# EAGLE design motor_ctrl_pw_v2 (EAGLE 5.06)
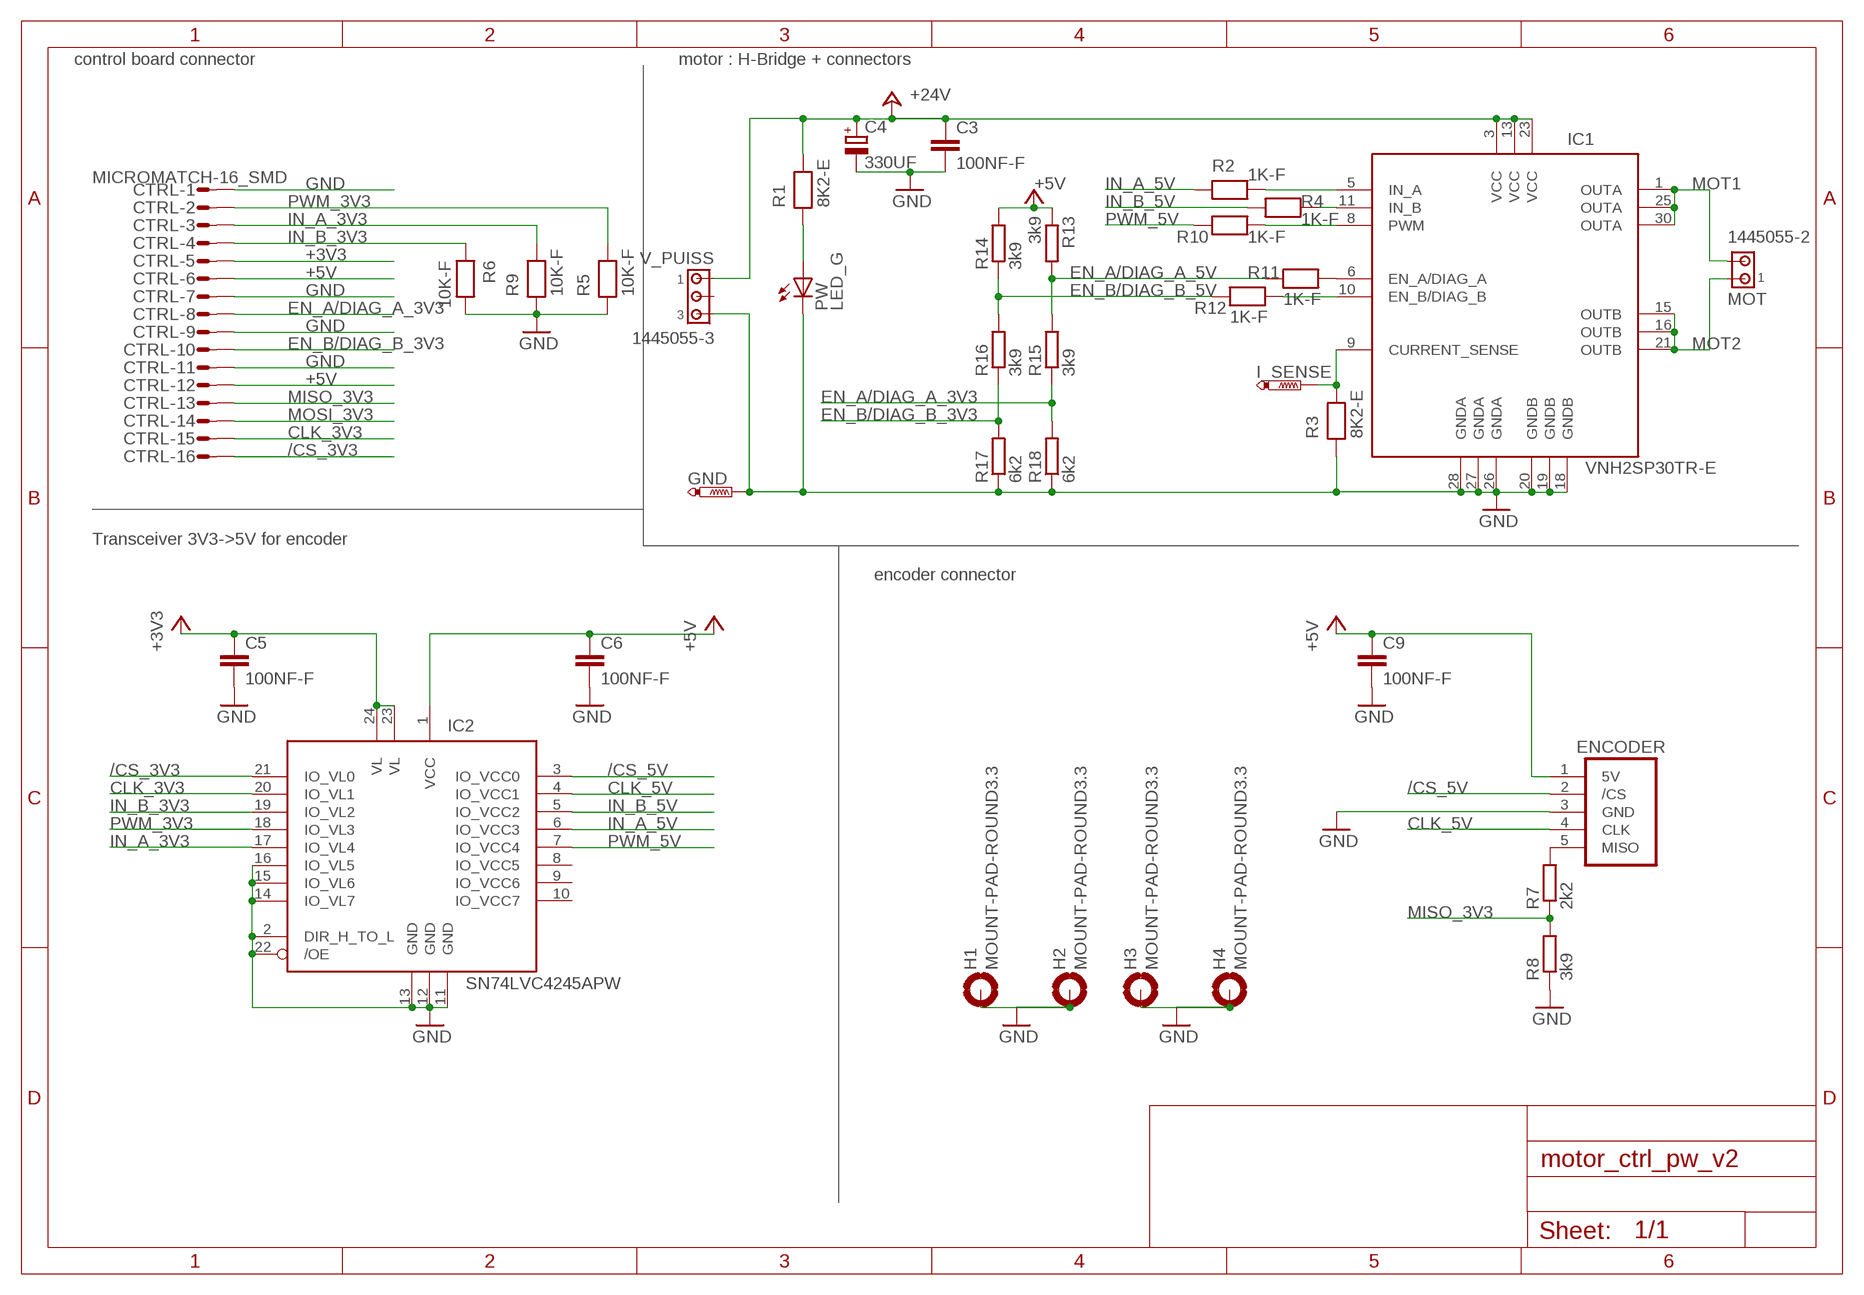
[diagram p0: schematic, sheet 1]

## Parts
C3  100NF-F  [C0603]
C4  330UF  [PANASONIC_G]
C5  100NF-F  [C0603]
C6  100NF-F  [C0603]
C9  100NF-F  [C0603]
CTRL  MICROMATCH-16_SMD  [MICROMATCH-16_SMD]
ENCODER  AEAT-601X  [53047-05]
GND  PTR1PAD1-13  [P1-13]
H1  MOUNT-PAD-ROUND3.3  [3,3-PAD]
H2  MOUNT-PAD-ROUND3.3  [3,3-PAD]
H3  MOUNT-PAD-ROUND3.3  [3,3-PAD]
H4  MOUNT-PAD-ROUND3.3  [3,3-PAD]
I_SENSE  PTR1PAD1-13  [P1-13]
IC1  VNH2SP30TR-E  [MULTIPOWER_SO-30]
IC2  SN74LVC4245APW  [TSSOP24]
MOT  1445055-2  [1445055-2]
PW  LED_G  [CHIP-LED0805]
R1  8K2-E  [R0805]
R2  1K-F  [R0603]
R3  8K2-E  [R0805]
R4  1K-F  [R0603]
R5  10K-F  [R0603]
R6  10K-F  [R0603]
R7  2k2  R-EU_R0603  [R0603]
R8  3k9  R-EU_R0603  [R0603]
R9  10K-F  [R0603]
R10  1K-F  [R0603]
R11  1K-F  [R0603]
R12  1K-F  [R0603]
R13  3k9  R-EU_R0603  [R0603]
R14  3k9  R-EU_R0603  [R0603]
R15  3k9  R-EU_R0603  [R0603]
R16  3k9  R-EU_R0603  [R0603]
R17  6k2  R-EU_R0603  [R0603]
R18  6k2  R-EU_R0603  [R0603]
V_PUISS  1445055-3  [1445055-3]

## Nets
+3V3: C5.1 CTRL.5 IC2.23(VL) IC2.24(VL)
+5V: C6.1 C9.1 CTRL.6 CTRL.12 ENCODER.1(5V) IC2.1(VCC) R13.1 R14.1
/CS_3V3: CTRL.16 IC2.21(IO_VL0)
/CS_5V: ENCODER.2(/CS) IC2.3(IO_VCC0)
CLK_3V3: CTRL.15 IC2.20(IO_VL1)
CLK_5V: ENCODER.4(CLK) IC2.4(IO_VCC1)
EN_A/DIAG_A_3V3: CTRL.8 R15.1 R18.2
EN_A/DIAG_A_5V: R11.1 R13.2 R15.2
EN_B/DIAG_B_3V3: CTRL.10 R16.1 R17.2
EN_B/DIAG_B_5V: R12.1 R14.2 R16.2
GND: C3.2 C4.- C5.2 C6.2 C9.2 CTRL.1 CTRL.7 CTRL.9 CTRL.11 ENCODER.3(GND) GND.1(TP) H1.B3,3(MOUNT) H2.B3,3(MOUNT) H3.B3,3(MOUNT) H4.B3,3(MOUNT) IC1.18(GNDB) IC1.19(GNDB) IC1.20(GNDB) IC1.26(GNDA) IC1.27(GNDA) IC1.28(GNDA) IC2.2(DIR_H_TO_L) IC2.11(GND) IC2.12(GND) IC2.13(GND) IC2.14(IO_VL7) IC2.15(IO_VL6) IC2.16(IO_VL5) IC2.22(/OE) PW.C R3.1 R5.1 R6.2 R8.1 R9.1 R17.1 R18.1 V_PUISS.3
IN_A_3V3: CTRL.3 IC2.17(IO_VL4) R9.2
IN_A_5V: IC2.7(IO_VCC4) R2.1
IN_B_3V3: CTRL.4 IC2.19(IO_VL2) R6.1
IN_B_5V: IC2.5(IO_VCC2) R4.1
MISO_3V3: CTRL.13 R7.1 R8.2
MOSI_3V3: CTRL.14
MOT1: IC1.1(OUTA) IC1.25(OUTA) IC1.30(OUTA) MOT.2
MOT2: IC1.15(OUTB) IC1.16(OUTB) IC1.21(OUTB) MOT.1
N$1: IC1.5(IN_A) R2.2
N$2: I_SENSE.1(TP) IC1.9(CURRENT_SENSE) R3.2
N$3: PW.A R1.1
N$5: IC1.11(IN_B) R4.2
N$6: IC1.8(PWM) R10.2
N$7: ENCODER.5(MISO) R7.2
N$8: IC1.6(EN_A/DIAG_A) R11.2
N$9: IC1.10(EN_B/DIAG_B) R12.2
PWM_3V3: CTRL.2 IC2.18(IO_VL3) R5.2
PWM_5V: IC2.6(IO_VCC3) R10.1
VCC: C3.1 C4.+ IC1.3(VCC) IC1.13(VCC) IC1.23(VCC) R1.2 V_PUISS.1 ; supply symbol labelled +24V
Unconnected: IC2.8(IO_VCC5) IC2.9(IO_VCC6) IC2.10(IO_VCC7) V_PUISS.2

## Notes on the sheet
- control board connector | motor : H-Bridge + connectors
- Transceiver 3V3->5V for encoder
- encoder connector

## Library data of the parts
C3 C5 C6 C9 = robotter_capacitor:100NF; VALUE: 100nF_0603_50V
C4 = robotter_capacitor:330UF; VALUE: EEEFK1V331P
CTRL = robotter_connector:MICROMATCH-16_SMD: MicroMaTch 16 FN : 1565592 / 8-215464-6 / 1-215464-6 Drawing Number C-215464 DDEController.pdf
ENCODER = robotter_connector:AEAT-601X
GND I_SENSE = testpad:PTR1: TEST PIN
H1-H4 = holes:MOUNT-PAD-ROUND: MOUNTING PAD, round
IC1 = robotter_ic:VNH2SP30TR-E
IC2 = robotter_ic:SN74LVC4245APW
MOT = con-amp:1445055-2: Micro MATE-N-LOK Connectors grid 1.5 mm Source: ENG_CD_1445055_A.pdf
PW = robotter_diode:LED_; VALUE: GREEN_0805
R1 R3 = robotter_resistor:8K2
R2 R4 R10-R12 = robotter_resistor:1K
R5 R6 R9 = robotter_resistor:10K
R7 R8 R13 R14 = resistor:R-EU_: RESISTOR, European symbol
R15-R18 = rcl:R-EU_: RESISTOR, European symbol
V_PUISS = con-amp:1445055-3: Micro MATE-N-LOK Connectors grid 1.5 mm Source: ENG_CD_1445055_A.pdf

## Board
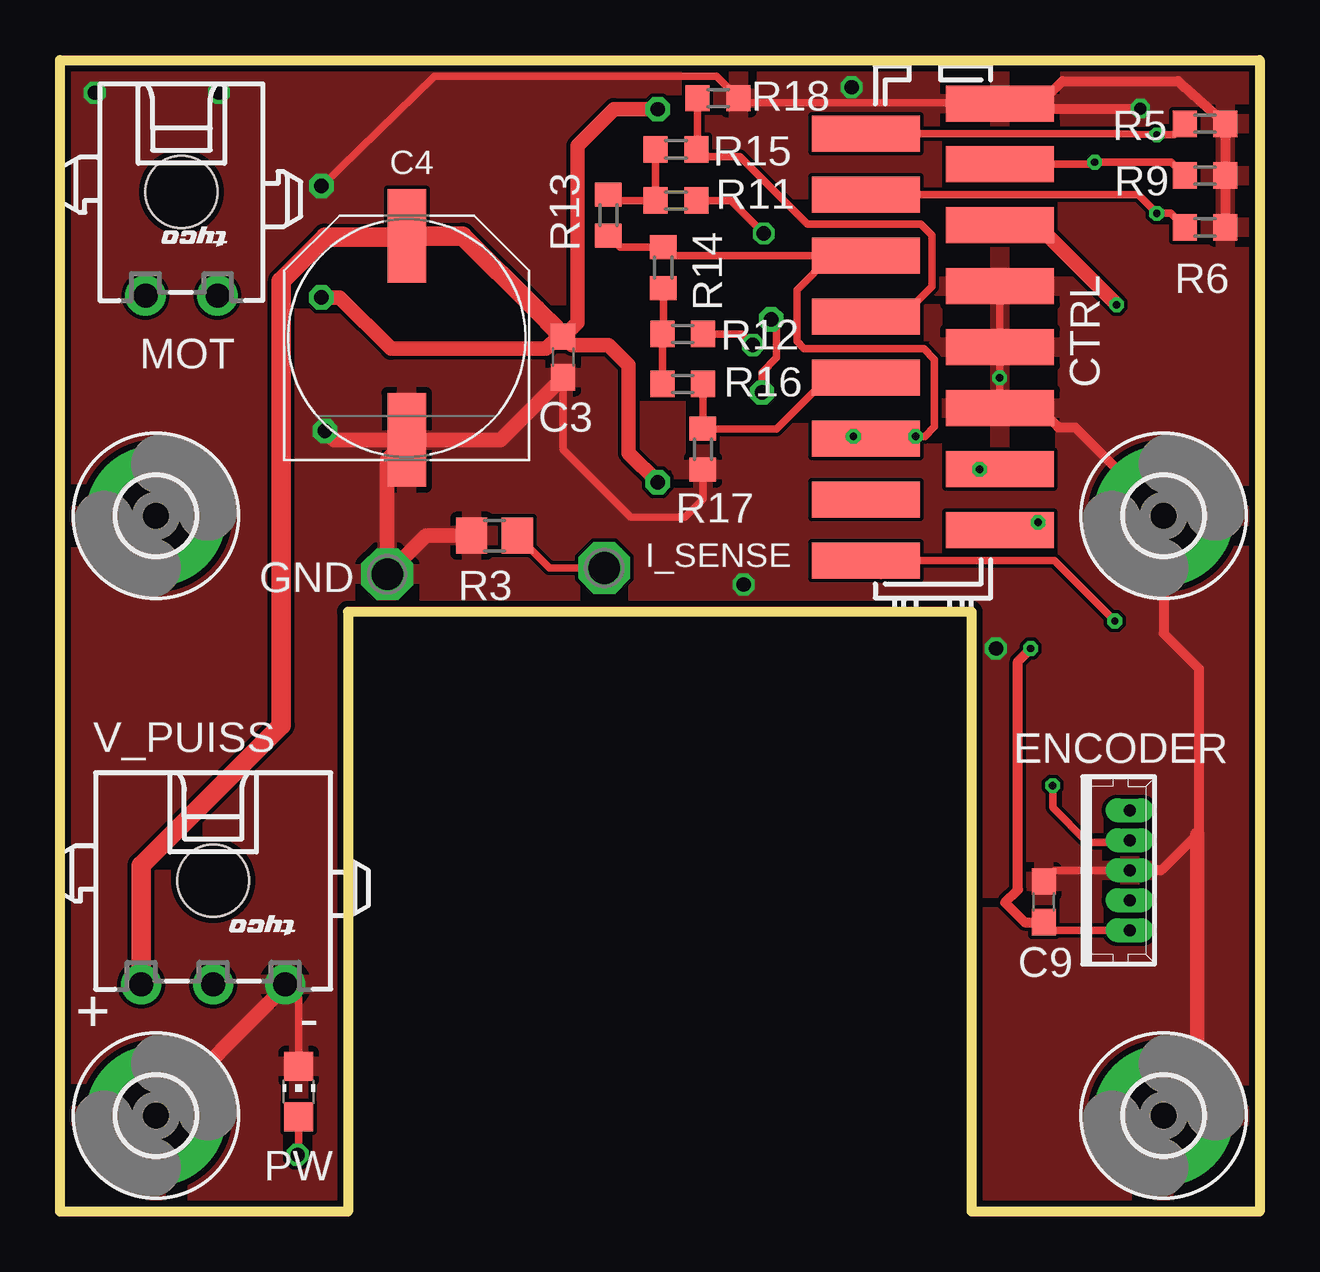
[diagram p1: board, top side]
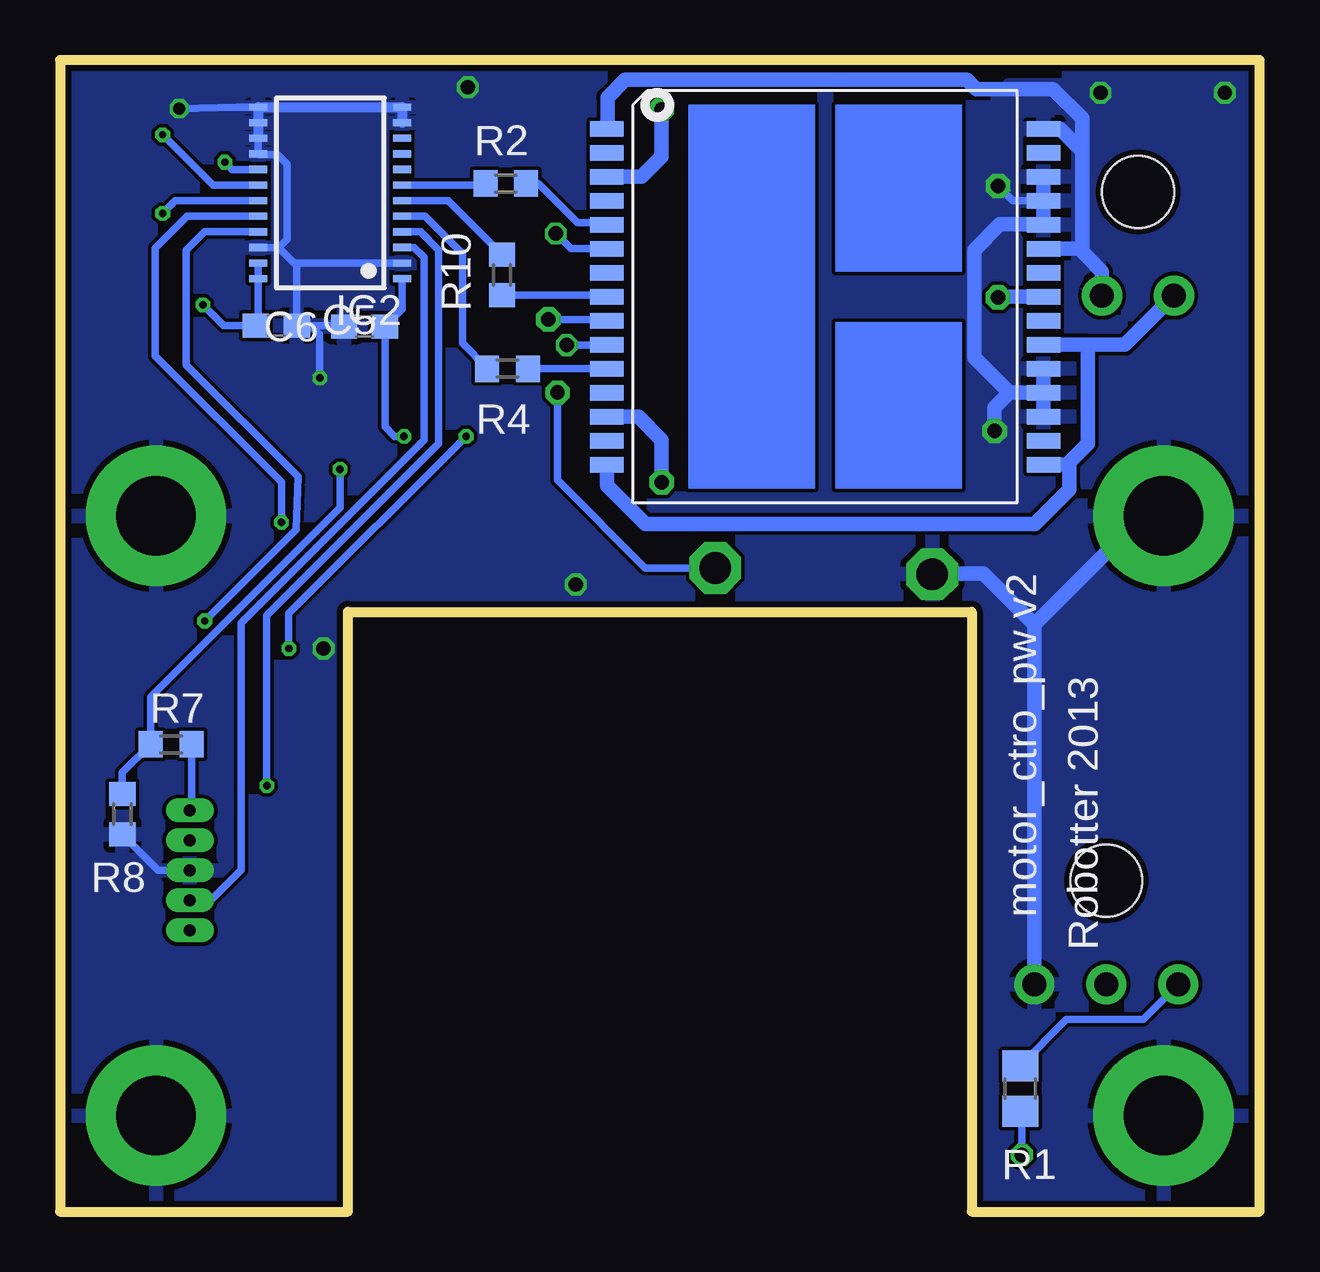
[diagram p2: board, bottom side, seen from below]

Size 50 x 48 mm. Coordinates in mm from the lower left corner, seen from the top.
Outline: 0,0 0,48 50,48 50,0 38,0 38,25 12,25 12,0 0,0
Copper layers (1*16): Top 0.035mm / dielectric 1.5mm / Bottom 0.035mm
Design rules "Fusion_eagle_rule_v1.1": minimum track width 6mil, minimum drill 12mil, track to track 6mil, track to pad 6mil, pad to pad 6mil, via to via 6mil, smd to smd 0mil, copper to edge 10mil, drill to drill 10mil, minimum pad ring 10mil, minimum via ring 6mil, stop-mask expansion 2mil, vias tented up to drill 100mil, thermal gap 10mil

### Footprints (pad centres in the part's own frame; a part is rotated, then mirrored left to right if it is on the bottom)
C0603 = smd 1.1 x 1: 1 -0.85,0; 2 0.85,0
PANASONIC_G = smd 3.9 x 1.6: + 4.25,0; - -4.25,0
MICROMATCH-16_SMD = smd 1.5 x 4.5: 1 9.525,-2.794; 2 8.255,2.794; 3 6.985,-2.794; 4 5.715,2.794; 5 4.445,-2.794; 6 3.175,2.794; 7 1.905,-2.794; 8 0.635,2.794; 9 -0.635,-2.794; 10 -1.905,2.794; 11 -3.175,-2.794; 12 -4.445,2.794; 13 -5.715,-2.794; 14 -6.985,2.794; 15 -8.255,-2.794; 16 -9.525,2.794
53047-05 = drill 0.5 pad 0.698 long: 1 2.5,0.45; 2 1.25,0.45; 3 0,0.45; 4 -1.25,0.45; 5 -2.5,0.45
P1-13 = drill 1.321 pad 2.159 octagon: 1 0,0
3,3-PAD = drill 3.3 pad 5.842 round: B3,3 0,0
MULTIPOWER_SO-30 = smd 1.4 x 0.65: 1 -9.1,7; 2 -9.1,6; 3 -9.1,5; 4 -9.1,4; 5 -9.1,3; 6 -9.1,2; 7 -9.1,1; 8 -9.1,0; 9 -9.1,-1; 10 -9.1,-2; 11 -9.1,-3; 12 -9.1,-4; 13 -9.1,-5; 14 -9.1,-6; 15 -9.1,-7; 16 9.1,-7; 17 9.1,-6; 18 9.1,-5; 19 9.1,-4; 20 9.1,-3; 21 9.1,-2; 22 9.1,-1; 23 9.1,0; 24 9.1,1; 25 9.1,2; 26 9.1,3; 27 9.1,4; 28 9.1,5; 29 9.1,6; 30 9.1,7
TSSOP24 = smd 0.3 x 0.75: 1 -3.575,-3; 2 -2.925,-3; 3 -2.275,-3; 4 -1.625,-3; 5 -0.975,-3; 6 -0.325,-3; 7 0.325,-3; 8 0.975,-3; 9 1.625,-3; 10 2.275,-3; 11 2.925,-3; 12 3.575,-3; 13 3.575,3; 14 2.925,3; 15 2.275,3; 16 1.625,3; 17 0.975,3; 18 0.325,3; 19 -0.325,3; 20 -0.975,3; 21 -1.625,3; 22 -2.275,3; 23 -2.925,3; 24 -3.575,3
1445055-2 = drill 1 pad 1.676 round: 1 1.5,4.32; 2 -1.5,4.32 | hole 3: 0,0
CHIP-LED0805 = smd 1.2 x 1.2: A 0,-1.05; C 0,1.05
R0805 = smd 1.3 x 1.5: 1 -0.95,0; 2 0.95,0
R0603 = smd 1 x 1.1: 1 -0.85,0; 2 0.85,0
1445055-3 = drill 1 pad 1.676 round: 1 3,4.32; 2 0,4.32; 3 -3,4.32 | hole 3: 0,0

### Placement (x,y rotation side)
C3  20.98,35.62 270 top
C4  14.45,36.42 90 top
C5  40.98,36.93 0 bottom
C6  37.31,36.89 180 bottom
C9  41.01,12.91 90 top
CTRL  36.39,36.66 90 top
ENCODER  44.13,14.22 270 top
GND  13.64,26.57 270 top
H1  46,4 0 top
H2  4,4 0 top
H3  4,29 0 top
H4  46,29 0 top
I_SENSE  22.68,26.83 90 top
IC1  18.11,38.13 0 bottom
IC2  38.74,42.46 90 bottom
MOT  5.06,42.5 180 top
PW  9.95,5 0 top
R1  9.98,5.12 90 bottom
R2  31.42,42.85 0 bottom
R3  18.11,28.18 0 top
R4  31.34,35.13 0 bottom
R5  47.73,45.34 180 top
R6  47.73,41.02 0 top
R7  45.37,19.48 0 bottom
R8  47.4,16.57 90 bottom
R9  47.73,43.18 180 top
R10  31.57,39.04 270 bottom
R11  25.68,42.14 0 top
R12  25.96,36.58 0 top
R13  22.86,41.53 90 top
R14  25.15,39.34 270 top
R15  25.68,44.27 180 top
R16  25.96,34.49 180 top
R17  26.8,31.78 90 top
R18  27.43,46.41 180 top
V_PUISS  6.39,13.79 180 top

### Tracks (layer width: path | path; a pad name or v marks a point on that pad's centre or on a via)
+3V3  (via drill 0.3)
  Top 0.61: CTRL.5 40.73,41.11 v44.04,37.8
  Bottom 0.305: IC2.23 IC2.24 41.74,37.03 C5.1 43.18,36.93 v44.04,37.8
+5V  (via drill 0.3)
  Top 0.305: C9.1 41.35,11.72 ENCODER.1 | R13.1 23.34,40.2 R14.1 25.5,39.84 32.99,39.84 | 32.99,39.84 32.14,39.84 30.71,38.41 30.71,36.27 31.01,35.97 36,35.97 36.46,35.51 36.46,32.72 36.04,32.31 v35.66,32.31 35.57,32.22 CTRL.12 32.7,32.22 v33.07,32.31 | 32.99,39.84 CTRL.6
  Top 0.406: C9.1 40.21,12.06 39.4,12.88 39.93,13.41 39.93,22.94 v40.46,23.47
  Bottom 0.305: ENCODER.1 44.62,11.75 | IC2.1 35.74,37.61 C6.1 36.46,32.72 36.04,32.31 v35.66,32.31 | v40.46,23.47 40.46,24.92 v33.07,32.31
/CS_3V3  (via drill 0.3)
  Top 0.305: 34.21,26.52 CTRL.16 41.44,27.14 v43.97,24.61
  Bottom 0.305: IC2.21 43.98,40.83 44.73,40.08 44.73,35.28 40.08,30.63 40.16,28.42 v43.97,24.61
/CS_5V
  Bottom 0.305: IC2.3 35.23,40.18 34.82,39.78 34.82,32.92 34.82,32.16 42.44,24.54 42.44,14.25 43.72,12.97 ENCODER.2
CLK_3V3  (via drill 0.3)
  Top 0.305: v40.77,28.73 40.67,28.41 CTRL.15
  Bottom 0.305: IC2.20 44.7,41.48 46.02,40.16 46.02,35.66 40.77,30.4 v40.77,28.73
CLK_5V  (via drill 0.3)
  Top 0.305: v41.38,17.75 41.38,16.84 42.82,15.39 44.5,15.39 ENCODER.4
  Bottom 0.305: IC2.4 34.97,40.83 34.21,40.08 34.21,32.69 34.21,32 41.38,24.84 v41.38,17.75
EN_A/DIAG_A_3V3
  Top 0.305: R15.1 26.58,44.33 | 26.58,44.33 R18.2 | 26.58,44.33 26.94,43.97 28.35,43.97 31.17,41.15 35.89,41.15 36.35,40.69 36.35,38.56 35.36,37.57 33.86,37.57 CTRL.8
EN_A/DIAG_A_5V
  Top 0.305: R13.2 23.1,42.14 R11.1 R15.2
EN_B/DIAG_B_3V3
  Top 0.305: 27.07,34.76 R16.1 R17.2 26.79,32.61 29.87,32.61 32.01,34.76 CTRL.10
EN_B/DIAG_B_5V
  Top 0.305: R16.2 R12.1 25.15,36.61 R14.2
GND  (via drill 0.3, 0.5, 0.6, 0.6 pad 1.02)
  Top 0.305: CTRL.7 CTRL.9 CTRL.11 39.18,34.73 v39.17,34.75 | C9.2 41.47,14.22 ENCODER.3 | 40.89,46.23 39.22,46.23 28.46,46.23 R18.1 27.37,47.32 15.62,47.32 v10.9,42.75 | PW.C 9.95,8.9 V_PUISS.3 | R17.1 26.8,29.69 26.06,28.96 23.77,28.96 20.98,31.75 C3.2
  Top 0.406: 39.22,46.23 CTRL.1 | R6.2 R9.1 R5.1 46.82,46.9 46.61,47.12 41.78,47.12 40.89,46.23 40.89,45.97 v45.03,45.97 | CTRL.11 40.81,33.49 41.6,32.69 42.31,32.69 H4.B3,3 46,24.1 47.47,22.63 47.47,15.79 R8.1 45.9,14.22 ENCODER.3
  Top 0.61: R3.1 15.25,28.18 GND.1 13.64,31.35 C4.- | C4.- 18.37,32.17 C3.2 | H2.B3,3 9.38,9.38 V_PUISS.3 | H1.B3,3 47.4,5.4 R8.1 | v11.05,32.54 11.42,32.17 C4.-
  Bottom 0.305: IC2.13 42.61,46.03 v45.03,45.97 | IC2.15 IC2.16 41.7,44.04 40.92,44.04 40.54,43.66 40.54,40.54 40.89,40.18 | 40.89,40.18 IC2.22 | 40.01,39.53 IC2.2 | 40.01,39.53 40.24,39.53 40.89,40.18 | 39.55,36.93 C5.2 40.13,39.41 40.01,39.53 | 39.55,36.93 38.2,36.93 C6.2 | v39.17,34.75 39.17,36.55 39.55,36.93 | ENCODER.3 45.9,14.22 R8.1 | v10.9,42.75 10.28,42.13 IC1.27
  Bottom 0.406: IC2.15 IC2.14 IC2.13 IC2.12 IC2.11
  Bottom 0.61: IC1.19 IC1.18 | IC1.19 IC1.20 | IC1.28 IC1.27 IC1.26 9.02,41.15 10.82,41.15 11.89,40.08 11.89,35.59 10.43,34.13 | 10.43,34.13 IC1.19 | V_PUISS.3 9.38,24.47 | 9.38,24.47 11.51,26.59 13.61,26.59 GND.1 | H3.B3,3 4.86,29 9.38,24.47 | 10.43,34.13 11.05,33.52 v11.05,32.54
  other vias: 28.5,26.14 39.01,23.47 32.99,46.86 1.45,46.63 6.63,46.63
  pour Top: -0.15,0 50.06,0 50.06,47.7 -0.15,47.7
  pour Bottom: 50.29,-0.15 0,-0.15 0,47.78 50.29,47.78
IN_A_3V3  (via drill 0.3)
  Top 0.305: 46.6,42.9 R9.2 46.32,43.74 v43.13,43.74 43.04,43.65 CTRL.3
  Bottom 0.305: IC2.17 42.83,43.43 v43.13,43.74
IN_A_5V
  Bottom 0.305: IC2.7 32.27,42.78 R2.1
IN_B_3V3  (via drill 0.3)
  Top 0.305: R6.1 46.29,41.6 v45.72,41.6 44.95,42.38 CTRL.4
  Bottom 0.305: IC2.19 45.19,42.13 v45.72,41.6
IN_B_5V
  Bottom 0.305: R4.1 32.19,35.16 33.22,36.2 33.22,39.93 34.78,41.48 IC2.5
MISO_3V3  (via drill 0.3)
  Top 0.305: v38.33,30.94 v38.34,30.95 CTRL.13
  Bottom 0.305: R8.2 47.4,18.29 R7.1 46.22,21.45 38.33,29.34 v38.33,30.94
MOT1
  Bottom 0.61: IC1.25 7.52,40.13 7.16,39.78 | 7.16,39.78 6.56,39.18 MOT.2 | IC1.30 8.33,45.13 7.39,44.2 | 7.39,44.2 7.39,40.01 7.16,39.78 | IC1.1 27.18,45.21 27.18,46.43 26.44,47.17 12.19,47.17 11.81,46.79 8.61,46.79 7.39,45.57 7.39,44.2
  pour Bottom: 6.71,38.1 6.71,46.41 7.24,46.94 10.44,46.94 10.9,46.48 10.9,45.57 10.44,45.11 8.31,45.11 7.85,44.65 7.54,44.35 7.54,42.52 7.54,38.94
MOT2
  Bottom 0.61: MOT.1 5.61,36.13 7.16,36.13 | 7.16,36.13 IC1.21 | IC1.16 8.03,31.13 7.92,31.24 | 7.92,31.24 7.16,32 7.16,36.13 | 27.21,30.94 IC1.15 27.2,30.25 25.6,28.65 9.37,28.65 7.92,30.1 7.92,31.24
N$1
  Bottom 0.305: R2.2 30.05,42.85 28.42,41.22 27.3,41.22 IC1.5
N$2  (via drill 0.6 pad 1.02)
  Top 0.305: R3.2 20.41,26.83 I_SENSE.1 | v29.26,34.14 29.26,34.98 29.87,35.59 29.87,36.96 v29.64,37.19
  Bottom 0.305: I_SENSE.1 25.61,26.83 29.26,30.48 v29.26,34.14 | v29.64,37.19 27.26,37.19 IC1.9
N$3  (via drill 0.6)
  Top 0.305: PW.A 9.95,2.41 v9.91,2.36
  Bottom 0.305: v9.91,2.36 9.91,4.1 R1.1
N$5
  Bottom 0.305: IC1.11 R4.2
N$6
  Bottom 0.305: R10.2 27.26,38.19 IC1.8
N$7
  Bottom 0.305: ENCODER.5 44.52,16.72 R7.2
N$8  (via drill 0.6)
  Top 0.305: v29.34,40.77 27.96,42.14 R11.2
  Bottom 0.305: IC1.6 28.7,40.13 v29.34,40.77
N$9  (via drill 0.6)
  Top 0.305: v28.88,36.12 28.42,36.58 R12.2
  Bottom 0.305: IC1.10 27.22,36.12 v28.88,36.12
PWM_3V3  (via drill 0.3)
  Top 0.305: v45.72,44.88 44,44.92 | CTRL.2 43.93,44.92 v45.72,44.88 | R5.2 46.42,44.88 v45.72,44.88
  Bottom 0.305: IC2.18 43.62,42.78 v45.72,44.88
PWM_5V
  Bottom 0.305: IC2.6 33.82,42.13 R10.1
VCC  (via drill 0.6 pad 1.02)
  Top 0.61: v10.9,38.1 11.66,38.1 13.79,35.97 20.27,35.97 20.77,36.47 C3.1 | C3.1 21.02,36.42 21.03,36.42 21.34,36.12 22.86,36.12 23.7,35.28 23.7,31.62 v24.92,30.4 | v24.92,45.95 23.09,45.95 21.57,44.42 21.57,37.06 C3.1
  Top 0.813: C3.1 20.34,37.11 19.84,37.62 16.79,40.67 C4.+ 14.51,40.62 11.05,40.62 9.22,38.79 9.22,20.27 3.38,14.43 V_PUISS.1
  Bottom 0.305: V_PUISS.1 4.85,8 8.05,8 R1.2
  Bottom 0.61: IC1.23 10.86,38.13 v10.9,38.1 | IC1.3 25.75,43.13 24.92,43.97 v24.92,45.95 | v24.92,30.4 24.92,32.16 25.89,33.13 IC1.13

### Text on the board
tNames: + | -
bNames: motor_ctro_pw v2 | Robotter 2013